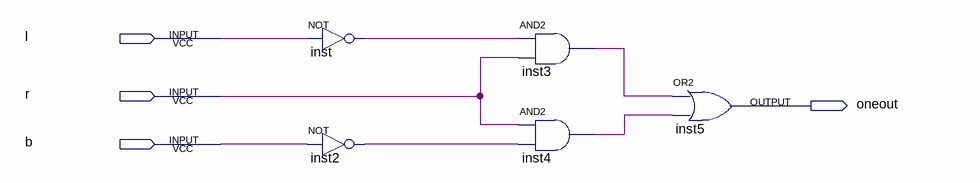
[diagram p0: schematic sheet]
// Quartus schematic a1.bdf as structural Verilog: 5 symbols, 4 pins
module a1 (
  input  l,
  input  r,
  input  b,
  output oneout
);

  wire inst2_out, inst3_out, inst4_out, inst_out;

  not inst (inst_out, l);
  not inst2 (inst2_out, b);
  and inst3 (inst3_out, inst_out, r);
  and inst4 (inst4_out, r, inst2_out);
  or inst5 (oneout, inst3_out, inst4_out);
endmodule
